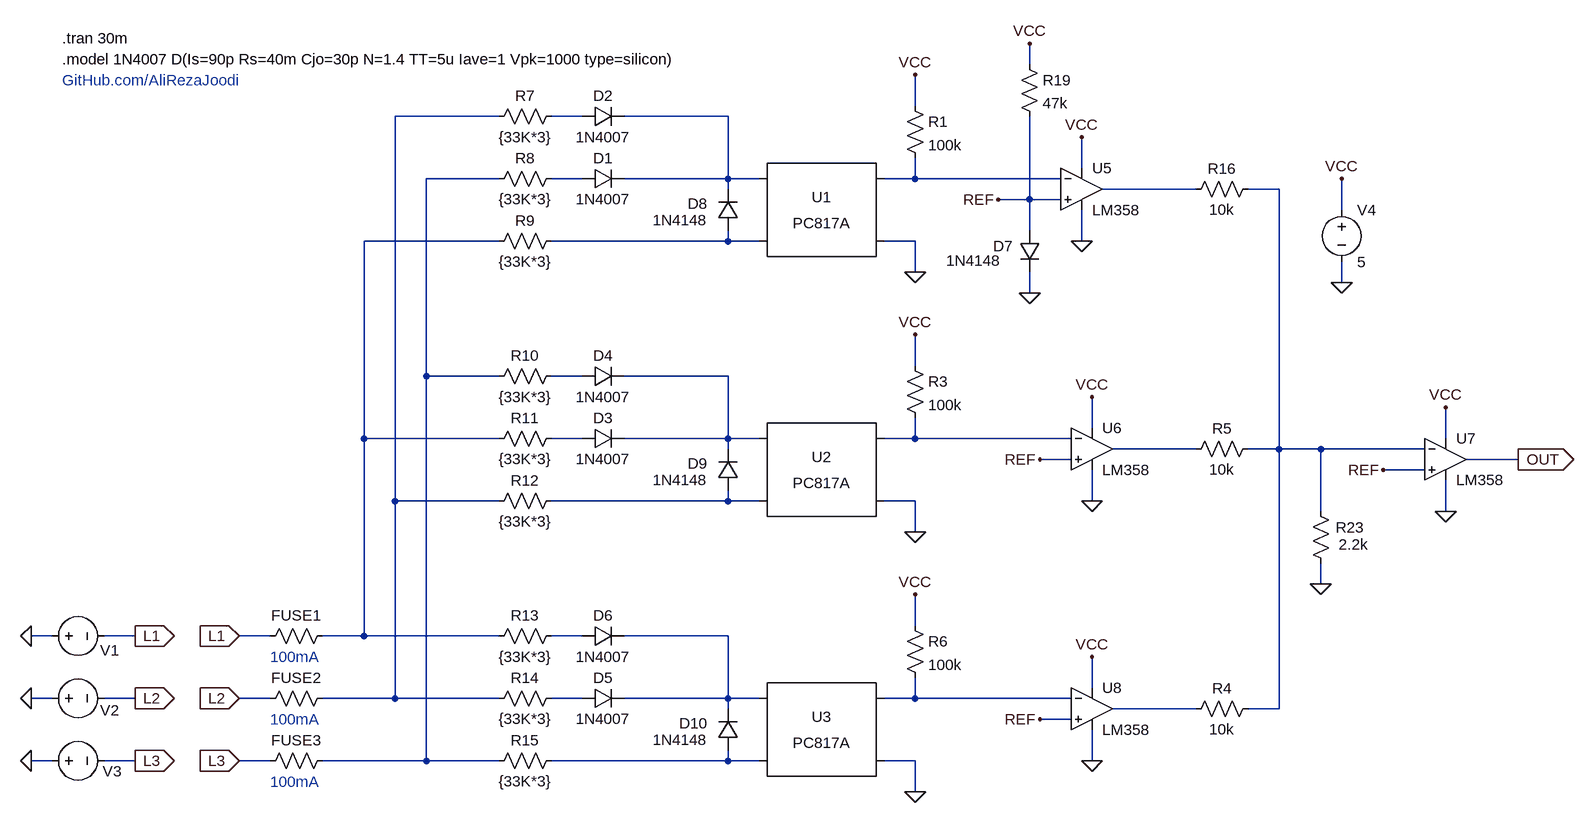
[diagram p0: schematic v1.0.asc]
v1.0.asc, the LTspice schematic file:
Version 4.1
SHEET 1 2556 1396
WIRE 928 -224 928 -256
WIRE 752 -160 752 -208
WIRE 112 -144 -48 -144
WIRE 240 -144 192 -144
WIRE 464 -144 304 -144
WIRE 1008 -64 1008 -112
WIRE 112 -48 0 -48
WIRE 240 -48 192 -48
WIRE 464 -48 464 -144
WIRE 464 -48 304 -48
WIRE 512 -48 464 -48
WIRE 752 -48 752 -80
WIRE 752 -48 704 -48
WIRE 976 -48 752 -48
WIRE 464 -32 464 -48
WIRE 1184 -32 1040 -32
WIRE 1312 -32 1264 -32
WIRE 928 -16 928 -144
WIRE 928 -16 880 -16
WIRE 976 -16 928 -16
WIRE 1408 0 1408 -48
WIRE 928 32 928 -16
WIRE 112 48 -96 48
WIRE 464 48 464 32
WIRE 464 48 192 48
WIRE 512 48 464 48
WIRE 752 48 704 48
WIRE 1008 48 1008 0
WIRE 752 96 752 48
WIRE 1408 112 1408 80
WIRE 928 128 928 96
WIRE 752 240 752 192
WIRE 0 256 0 -48
WIRE 112 256 0 256
WIRE 240 256 192 256
WIRE 464 256 304 256
WIRE 1024 336 1024 288
WIRE -96 352 -96 48
WIRE 112 352 -96 352
WIRE 240 352 192 352
WIRE 464 352 464 256
WIRE 464 352 304 352
WIRE 512 352 464 352
WIRE 752 352 752 320
WIRE 752 352 704 352
WIRE 992 352 752 352
WIRE 1568 352 1568 304
WIRE 464 368 464 352
WIRE 1184 368 1056 368
WIRE 1312 368 1312 -32
WIRE 1312 368 1264 368
WIRE 1376 368 1312 368
WIRE 1536 368 1376 368
WIRE 992 384 944 384
WIRE 1680 384 1600 384
WIRE 1536 400 1472 400
WIRE -48 448 -48 -144
WIRE 112 448 -48 448
WIRE 464 448 464 432
WIRE 464 448 192 448
WIRE 512 448 464 448
WIRE 752 448 704 448
WIRE 1024 448 1024 400
WIRE 1376 464 1376 368
WIRE 1568 464 1568 416
WIRE 752 496 752 448
WIRE 1376 576 1376 544
WIRE 752 640 752 592
WIRE -576 656 -608 656
WIRE -448 656 -496 656
WIRE -240 656 -288 656
WIRE -96 656 -96 352
WIRE -96 656 -160 656
WIRE 112 656 -96 656
WIRE 240 656 192 656
WIRE 464 656 304 656
WIRE 1024 736 1024 688
WIRE -576 752 -608 752
WIRE -448 752 -496 752
WIRE -240 752 -288 752
WIRE -48 752 -48 448
WIRE -48 752 -160 752
WIRE 112 752 -48 752
WIRE 240 752 192 752
WIRE 464 752 464 656
WIRE 464 752 304 752
WIRE 512 752 464 752
WIRE 752 752 752 720
WIRE 752 752 704 752
WIRE 992 752 752 752
WIRE 464 768 464 752
WIRE 1184 768 1056 768
WIRE 1312 768 1312 368
WIRE 1312 768 1264 768
WIRE 992 784 944 784
WIRE -576 848 -608 848
WIRE -448 848 -496 848
WIRE -240 848 -288 848
WIRE 0 848 0 256
WIRE 0 848 -160 848
WIRE 112 848 0 848
WIRE 464 848 464 832
WIRE 464 848 192 848
WIRE 512 848 464 848
WIRE 752 848 704 848
WIRE 1024 848 1024 800
WIRE 752 896 752 848
FLAG -608 656 0
FLAG -608 752 0
FLAG -608 848 0
FLAG 752 96 0
FLAG 1408 112 0
FLAG 1408 -48 VCC
FLAG 752 -208 VCC
FLAG -448 656 L1
IOPIN -448 656 Out
FLAG -448 752 L2
IOPIN -448 752 Out
FLAG -448 848 L3
IOPIN -448 848 Out
FLAG 752 496 0
FLAG 752 192 VCC
FLAG 752 896 0
FLAG 752 592 VCC
FLAG 1008 -112 VCC
FLAG 1008 48 0
FLAG 1024 288 VCC
FLAG 1024 448 0
FLAG 1024 688 VCC
FLAG 1024 848 0
FLAG 1680 384 OUT
IOPIN 1680 384 Out
FLAG 928 128 0
FLAG 928 -256 VCC
FLAG 1568 304 VCC
FLAG 1568 464 0
FLAG 1376 576 0
FLAG 880 -16 REF
FLAG 944 384 REF
FLAG 944 784 REF
FLAG 1472 400 REF
FLAG -288 656 L1
IOPIN -288 656 In
FLAG -288 752 L2
IOPIN -288 752 In
FLAG -288 848 L3
IOPIN -288 848 In
SYMBOL voltage -592 656 R270
WINDOW 3 -49 -161 Invisible 2
WINDOW 123 0 0 Left 0
WINDOW 39 0 0 Left 0
WINDOW 0 -22 90 VRight 2
SYMATTR Value SINE(0 310 50 0 0 0)
SYMATTR InstName V1
SYMBOL voltage -592 752 R270
WINDOW 3 -50 -158 Invisible 2
WINDOW 123 0 0 Left 0
WINDOW 39 0 0 Left 0
WINDOW 0 -18 90 VRight 2
SYMATTR Value SINE(0 310 50 0 0 120)
SYMATTR InstName V2
SYMBOL voltage -592 848 R270
WINDOW 3 -52 -136 Invisible 2
WINDOW 123 0 0 Left 0
WINDOW 39 0 0 Left 0
WINDOW 0 -16 94 VRight 2
SYMATTR Value SINE(0 310 50 0 0 240)
SYMATTR InstName V3
SYMBOL Optos\\PC817A 608 0 R0
SYMATTR InstName U1
SYMBOL res 736 -176 R0
SYMATTR InstName R1
SYMATTR Value 100k
SYMBOL voltage 1408 -16 R0
WINDOW 123 0 0 Left 0
WINDOW 39 0 0 Left 0
SYMATTR InstName V4
SYMATTR Value 5
SYMBOL diode 240 -32 R270
WINDOW 0 32 32 VTop 2
WINDOW 3 0 32 VBottom 2
SYMATTR InstName D1
SYMATTR Value 1N4007
SYMBOL diode 240 -128 R270
WINDOW 0 32 32 VTop 2
WINDOW 3 0 32 VBottom 2
SYMATTR InstName D2
SYMATTR Value 1N4007
SYMBOL Optos\\PC817A 608 400 R0
SYMATTR InstName U2
SYMBOL res 736 224 R0
SYMATTR InstName R3
SYMATTR Value 100k
SYMBOL diode 240 368 R270
WINDOW 0 32 32 VTop 2
WINDOW 3 0 32 VBottom 2
SYMATTR InstName D3
SYMATTR Value 1N4007
SYMBOL diode 240 272 R270
WINDOW 0 32 32 VTop 2
WINDOW 3 0 32 VBottom 2
SYMATTR InstName D4
SYMATTR Value 1N4007
SYMBOL Optos\\PC817A 608 800 R0
SYMATTR InstName U3
SYMBOL res 736 624 R0
SYMATTR InstName R6
SYMATTR Value 100k
SYMBOL diode 240 768 R270
WINDOW 0 32 32 VTop 2
WINDOW 3 0 32 VBottom 2
SYMATTR InstName D5
SYMATTR Value 1N4007
SYMBOL diode 240 672 R270
WINDOW 0 32 32 VTop 2
WINDOW 3 0 32 VBottom 2
SYMATTR InstName D6
SYMATTR Value 1N4007
SYMBOL res 96 -128 R270
WINDOW 0 32 56 VTop 2
WINDOW 3 0 56 VBottom 2
SYMATTR InstName R7
SYMATTR Value {33K*3}
SYMBOL res 96 -32 R270
WINDOW 0 32 56 VTop 2
WINDOW 3 0 56 VBottom 2
SYMATTR InstName R8
SYMATTR Value {33K*3}
SYMBOL res 96 64 R270
WINDOW 0 32 56 VTop 2
WINDOW 3 0 56 VBottom 2
SYMATTR InstName R9
SYMATTR Value {33K*3}
SYMBOL res 96 272 R270
WINDOW 0 32 56 VTop 2
WINDOW 3 0 56 VBottom 2
SYMATTR InstName R10
SYMATTR Value {33K*3}
SYMBOL res 96 368 R270
WINDOW 0 32 56 VTop 2
WINDOW 3 0 56 VBottom 2
SYMATTR InstName R11
SYMATTR Value {33K*3}
SYMBOL res 96 464 R270
WINDOW 0 32 56 VTop 2
WINDOW 3 0 56 VBottom 2
SYMATTR InstName R12
SYMATTR Value {33K*3}
SYMBOL res 96 672 R270
WINDOW 0 32 56 VTop 2
WINDOW 3 0 56 VBottom 2
SYMATTR InstName R13
SYMATTR Value {33K*3}
SYMBOL res 96 768 R270
WINDOW 0 32 56 VTop 2
WINDOW 3 0 56 VBottom 2
SYMATTR InstName R14
SYMATTR Value {33K*3}
SYMBOL res 96 864 R270
WINDOW 0 32 56 VTop 2
WINDOW 3 0 56 VBottom 2
SYMATTR InstName R15
SYMATTR Value {33K*3}
SYMBOL res 1280 752 R90
WINDOW 0 0 56 VBottom 2
WINDOW 3 32 56 VTop 2
SYMATTR InstName R4
SYMATTR Value 10k
SYMBOL res 1280 352 R90
WINDOW 0 0 56 VBottom 2
WINDOW 3 32 56 VTop 2
SYMATTR InstName R5
SYMATTR Value 10k
SYMBOL res 1280 -48 R90
WINDOW 0 0 56 VBottom 2
WINDOW 3 32 56 VTop 2
SYMATTR InstName R16
SYMATTR Value 10k
SYMBOL diode 912 32 R0
WINDOW 0 -40 24 Left 2
WINDOW 3 -112 46 Left 2
SYMATTR InstName D7
SYMATTR Value 1N4148
SYMBOL res 912 -240 R0
SYMATTR InstName R19
SYMATTR Value 47k
SYMBOL res 1392 560 R180
WINDOW 0 -51 71 Left 2
WINDOW 3 -57 45 Left 2
SYMATTR InstName R23
SYMATTR Value 2.2k
SYMBOL diode 480 32 R180
WINDOW 0 47 42 Left 2
WINDOW 3 47 16 Left 2
SYMATTR InstName D8
SYMATTR Value 1N4148
SYMBOL diode 480 432 R180
WINDOW 0 47 42 Left 2
WINDOW 3 47 16 Left 2
SYMATTR InstName D9
SYMATTR Value 1N4148
SYMBOL diode 480 832 R180
WINDOW 0 47 42 Left 2
WINDOW 3 47 16 Left 2
SYMATTR InstName D10
SYMATTR Value 1N4148
SYMBOL MyLib\\OpAmp\\LM358 1008 -96 R0
WINDOW 38 27 90 Left 2
SYMATTR InstName U5
SYMBOL MyLib\\OpAmp\\LM358 1024 304 R0
WINDOW 38 30 88 Left 2
SYMATTR InstName U6
SYMBOL MyLib\\OpAmp\\LM358 1568 320 R0
WINDOW 38 30 92 Left 2
SYMATTR InstName U7
SYMBOL MyLib\\OpAmp\\LM358 1024 704 R0
WINDOW 38 25 89 Left 2
SYMATTR InstName U8
SYMBOL res -144 640 R90
WINDOW 0 0 56 VBottom 2
WINDOW 3 32 56 Invisible 2
SYMATTR InstName FUSE1
SYMATTR Value 0.01
SYMBOL res -144 736 R90
WINDOW 0 0 56 VBottom 2
WINDOW 3 32 56 Invisible 2
SYMATTR InstName FUSE2
SYMATTR Value 0.01
SYMBOL res -144 832 R90
WINDOW 0 0 56 VBottom 2
WINDOW 3 32 56 Invisible 2
SYMATTR InstName FUSE3
SYMATTR Value 0.01
TEXT -560 -264 Left 2 !.tran 30m
TEXT -560 -232 Left 2 !.model 1N4007 D(Is=90p Rs=40m Cjo=30p N=1.4 TT=5u Iave=1 Vpk=1000 type=silicon)
TEXT -560 -200 Left 2 ;GitHub.com/AliRezaJoodi
TEXT -240 688 Left 2 ;100mA
TEXT -240 784 Left 2 ;100mA
TEXT -240 880 Left 2 ;100mA

The netlist it stands for:
* v1.0.asc
V1 0 L1 SINE(0 310 50 0 0 0)
V2 0 L2 SINE(0 310 50 0 0 120)
V3 0 L3 SINE(0 310 50 0 0 240)
X§U1 N003 N010 N006 0 PC817 Igain=1m
R1 VCC N006 100k
V4 VCC 0 5
D1 N005 N003 1N4007
D2 N002 N003 1N4007
X§U2 N012 N016 N014 0 PC817 Igain=1m
R3 VCC N014 100k
D3 N013 N012 1N4007
D4 N011 N012 1N4007
X§U3 N018 N022 N020 0 PC817 Igain=1m
R6 VCC N020 100k
D5 N019 N018 1N4007
D6 N017 N018 1N4007
R7 N001 N002 {33K*3}
R8 N004 N005 {33K*3}
R9 N009 N010 {33K*3}
R10 N004 N011 {33K*3}
R11 N009 N013 {33K*3}
R12 N001 N016 {33K*3}
R13 N009 N017 {33K*3}
R14 N001 N019 {33K*3}
R15 N004 N022 {33K*3}
R4 N008 N021 10k
R5 N008 N015 10k
R16 N008 N007 10k
D7 REF 0 1N4148
R19 VCC REF 47k
R23 0 N008 2.2k
D8 N010 N003 1N4148
D9 N016 N012 1N4148
D10 N022 N018 1N4148
* U5: LM358 (symbol MyLib\OpAmp\LM358 not available, pins judged from their places): In+=REF In-=N006 V+=VCC V-=0 OUT=N007
* U6: LM358 (symbol MyLib\OpAmp\LM358 not available, pins judged from their places): In+=REF In-=N014 V+=VCC V-=0 OUT=N015
* U7: LM358 (symbol MyLib\OpAmp\LM358 not available, pins judged from their places): In+=REF In-=N008 V+=VCC V-=0 OUT=OUT
* U8: LM358 (symbol MyLib\OpAmp\LM358 not available, pins judged from their places): In+=REF In-=N020 V+=VCC V-=0 OUT=N021
R§FUSE1 N009 L1 0.01
R§FUSE2 N001 L2 0.01
R§FUSE3 N004 L3 0.01
.model D D
.lib standard.dio
.tran 30m
.model 1N4007 D(Is=90p Rs=40m Cjo=30p N=1.4 TT=5u Iave=1 Vpk=1000 type=silicon)
* GitHub.com/AliRezaJoodi
* 100mA
* 100mA
* 100mA
.lib PC817.sub
.backanno
.end